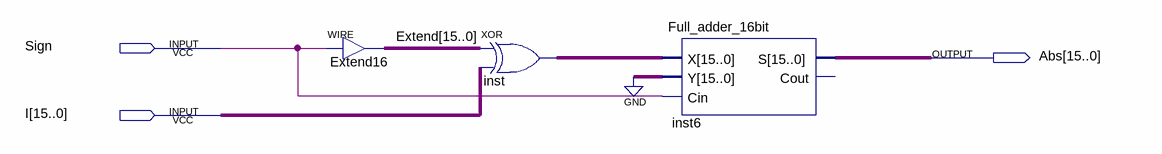
[diagram p0: schematic sheet]
// Quartus schematic Abs.bdf as structural Verilog: 3 symbols, 3 pins
module Abs (
  input  Sign,
  input  [15:0] I,
  output [15:0] Abs
);

  wire [15:0] Extend, inst_out;

  assign Extend = {16{Sign}};  // WIRE Extend16
  assign inst_out = Extend ^ I;  // XOR inst, 16 bits wide
  Full_adder_16bit inst6 (.X(inst_out), .Y({16{1'b0}}), .Cin(Sign), .S(Abs));  // open: Cout
endmodule
